# Altium schematic sheet CPU.SchDoc
size A3
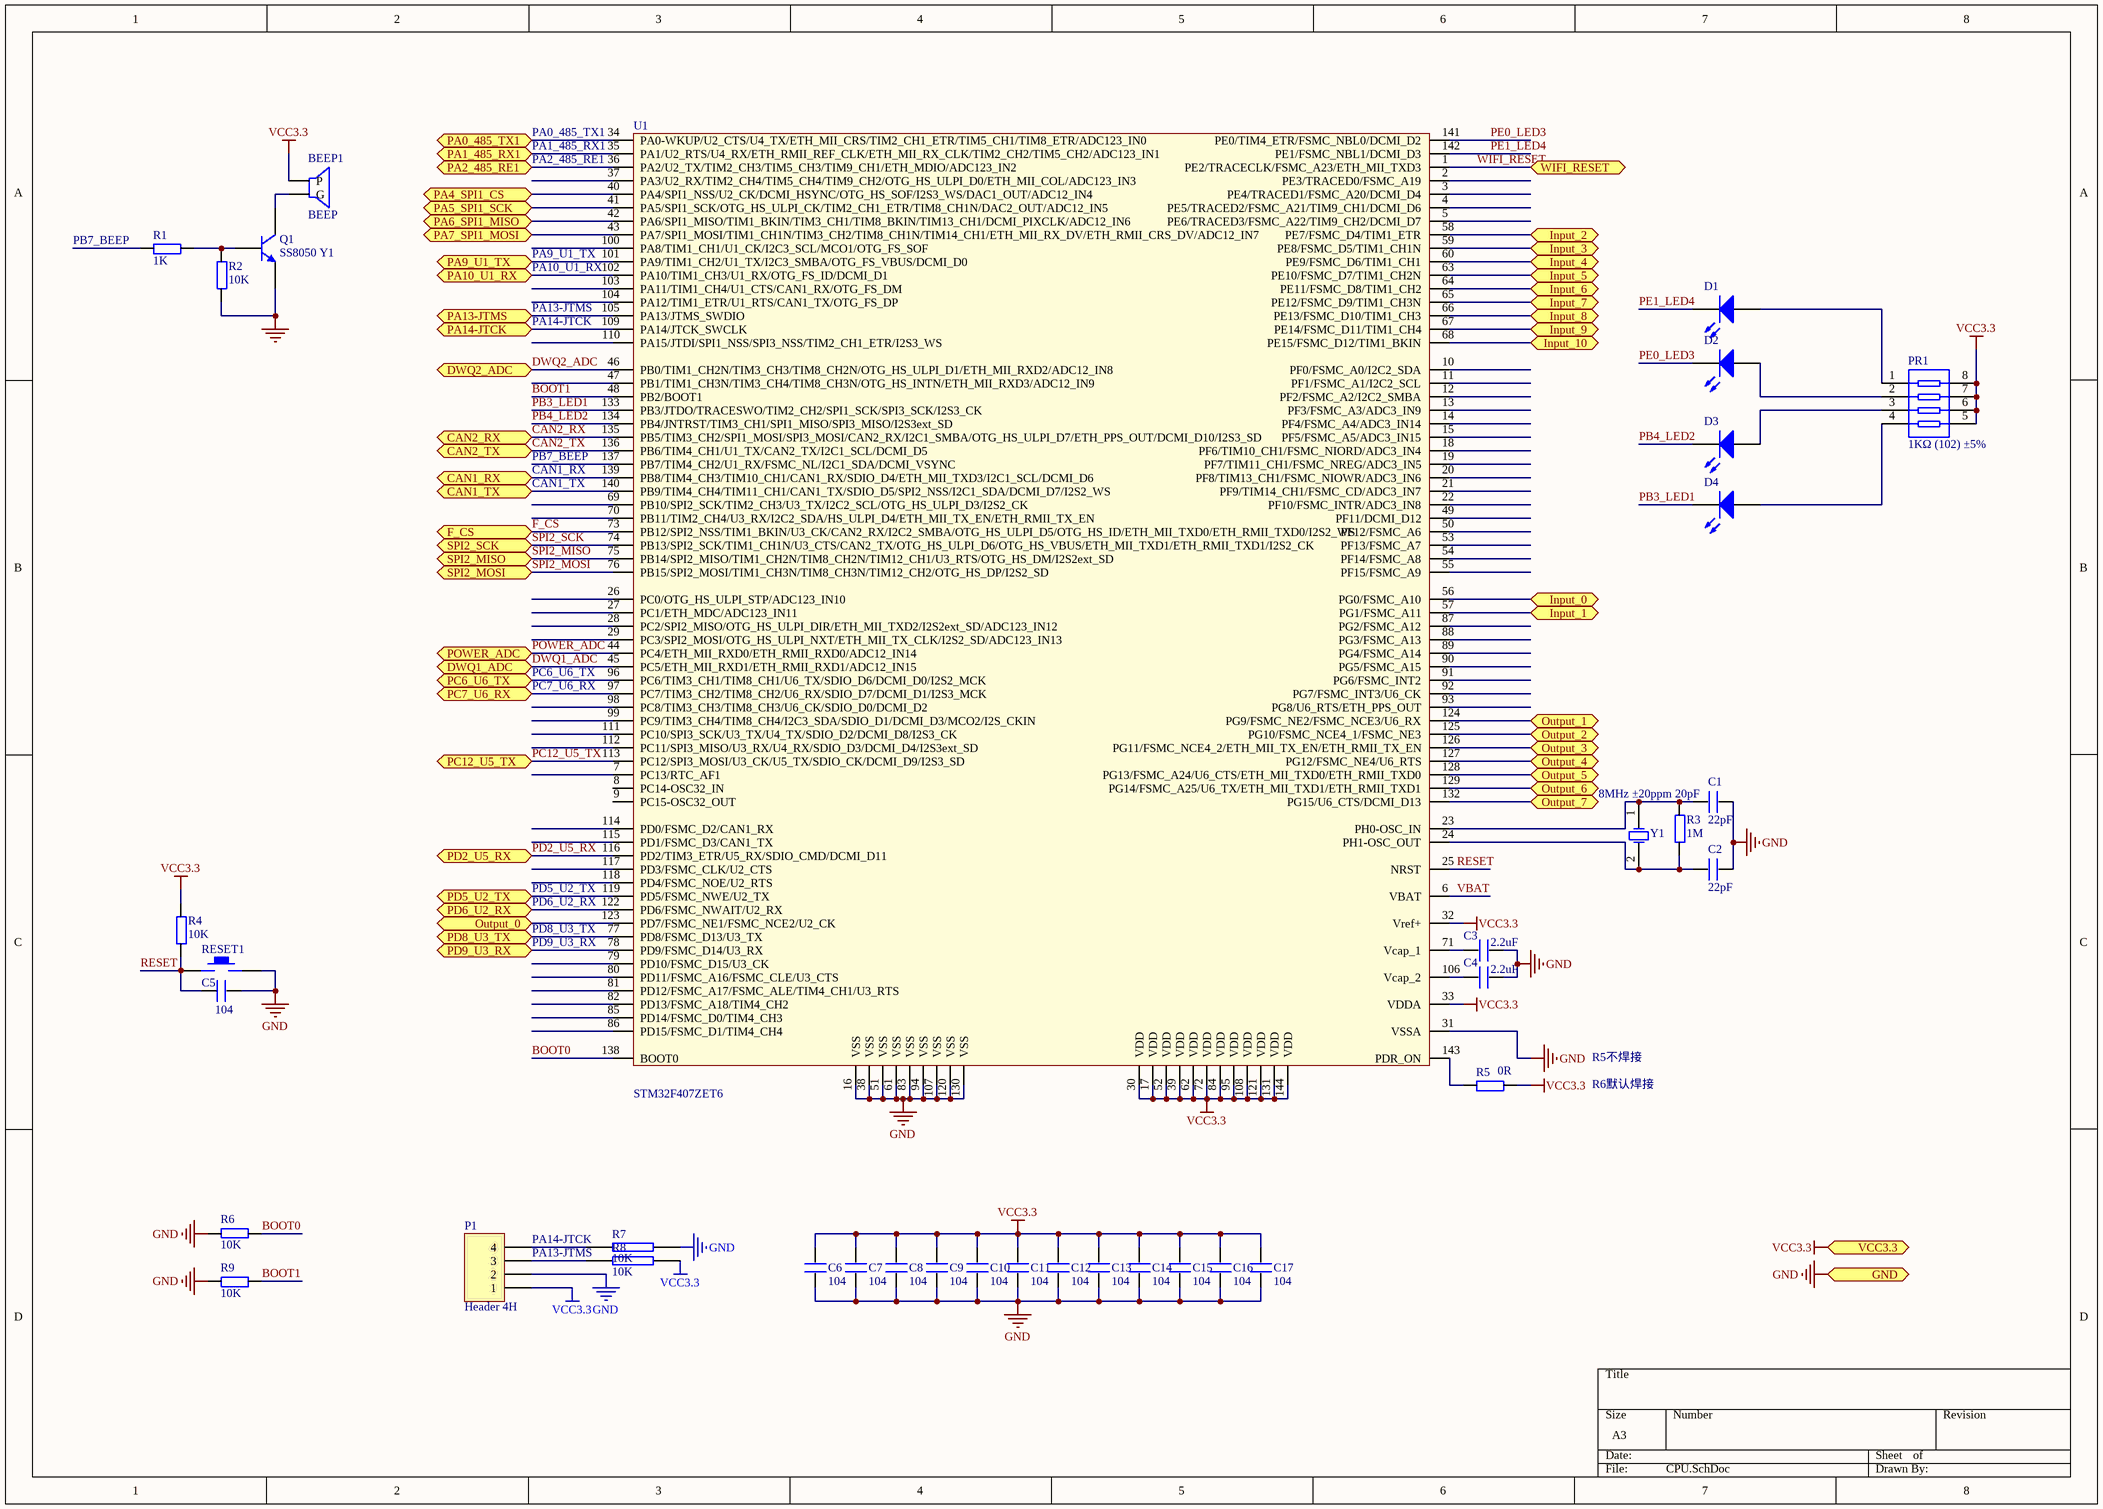
[diagram p0: CPU.SchDoc]

## Parts
BEEP1  BEEP  [BELL-5]
C1  22pF  [0603_C]
C2  22pF  [0603_C]
C3  2.2uF  [0603_C]
C4  2.2uF  [0603_C]
C5  104  [0603_C]
C6  104  [0603_C]
C7  104  [0603_C]
C8  104  [0603_C]
C9  104  [0603_C]
C10  104  [0603_C]
C11  104  [0603_C]
C12  104  [0603_C]
C13  104  [0603_C]
C14  104  [0603_C]
C15  104  [0603_C]
C16  104  [0603_C]
C17  104  [0603_C]
D1  红灯 0805  [LC-0805_LED_S1]  (value not drawn)
D2  红灯 0805  [LC-0805_LED_S1]  (value not drawn)
D3  红灯 0805  [LC-0805_LED_S1]  (value not drawn)
D4  红灯 0805  [LC-0805_LED_S1]  (value not drawn)
P1  Header 4H  [IDE4]
PR1  1KΩ (102) ±5%  [0603_Rx4]
Q1  SS8050 Y1  [SOT-23(SOT-23-3)]
R1  1K  [0603_R]
R2  10K  [0603_R]
R3  1M  [0603_R]
R4  10K  [0603_R]
R5  0R  [0603_R]
R6  10K  [0603_R]
R7  10K  [0603_R]
R8  10K  [0603_R]
R9  10K  [0603_R]
RESET1  KEY_M  [SW_PB2_A1]  (value not drawn)
U1  STM32F407ZET6  [LQFP-144_20x20x05P]
Y1  8MHz ±20ppm 20pF  [SMD-5032_2P]

## Ports
CAN1_RX, CAN1_TX, CAN2_RX, CAN2_TX, DWQ1_ADC, DWQ2_ADC, F_CS, GND, Input_0, Input_1, Input_2, Input_3, Input_4, Input_5, Input_6, Input_7, Input_8, Input_9, Input_10, Output_0, Output_1, Output_2, Output_3, Output_4, Output_5, Output_6, Output_7, PA0_485_TX1, PA1_485_RX1, PA2_485_RE1, PA4_SPI1_CS, PA5_SPI1_SCK, PA6_SPI1_MISO, PA7_SPI1_MOSI, PA9_U1_TX, PA10_U1_RX, PA13-JTMS, PA14-JTCK, PC6_U6_TX, PC7_U6_RX, PC12_U5_TX, PD2_U5_RX, PD5_U2_TX, PD6_U2_RX, PD8_U3_TX, PD9_U3_RX, POWER_ADC, SPI2_MISO, SPI2_MOSI, SPI2_SCK, VCC3.3, WIFI_RESET

## Nets
GND: C1.1 C2.1 C3.2 C4.2 C5.2 C6.1 C7.1 C8.1 C9.1 C10.1 C11.1 C12.1 C13.1 C14.1 C15.1 C16.1 C17.1 P1.2 Q1.2(E) R2.1 R6.2 R7.1 R9.1 RESET1.2 U1.16(VSS) U1.31(VSSA) U1.38(VSS) U1.51(VSS) U1.61(VSS) U1.83(VSS) U1.94(VSS) U1.107(VSS) U1.120(VSS) U1.130(VSS) ; port GND
VCC3.3: BEEP1.1(P) C6.2 C7.2 C8.2 C9.2 C10.2 C11.2 C12.2 C13.2 C14.2 C15.2 C16.2 C17.2 P1.1 PR1.5 PR1.6 PR1.7 PR1.8 R4.2 R5.2 R8.1 U1.17(VDD) U1.30(VDD) U1.32(Vref+) U1.33(VDDA) U1.39(VDD) U1.52(VDD) U1.62(VDD) U1.72(VDD) U1.84(VDD) U1.95(VDD) U1.108(VDD) U1.121(VDD) U1.131(VDD) U1.144(VDD) ; port VCC3.3
BOOT0: R6.1 U1.138(BOOT0)
BOOT1: R9.2 U1.48(PB2/BOOT1)
CAN1_RX: U1.139(PB8/TIM4_CH3/TIM10_CH1/CAN1_RX/SDIO_D4/ETH_MII_TXD3/I2C1_SCL/DCMI_D6) ; port CAN1_RX
CAN1_TX: U1.140(PB9/TIM4_CH4/TIM11_CH1/CAN1_TX/SDIO_D5/SPI2_NSS/I2C1_SDA/DCMI_D7/I2S2_WS) ; port CAN1_TX
CAN2_RX: U1.135(PB5/TIM3_CH2/SPI1_MOSI/SPI3_MOSI/CAN2_RX/I2C1_SMBA/OTG_HS_ULPI_D7/ETH_PPS_OUT/DCMI_D10/I2S3_SD) ; port CAN2_RX
CAN2_TX: U1.136(PB6/TIM4_CH1/U1_TX/CAN2_TX/I2C1_SCL/DCMI_D5) ; port CAN2_TX
DWQ1_ADC: U1.45(PC5/ETH_MII_RXD1/ETH_RMII_RXD1/ADC12_IN15) ; port DWQ1_ADC
DWQ2_ADC: U1.46(PB0/TIM1_CH2N/TIM3_CH3/TIM8_CH2N/OTG_HS_ULPI_D1/ETH_MII_RXD2/ADC12_IN8) ; port DWQ2_ADC
F_CS: U1.73(PB12/SPI2_NSS/TIM1_BKIN/U3_CK/CAN2_RX/I2C2_SMBA/OTG_HS_ULPI_D5/OTG_HS_ID/ETH_MII_TXD0/ETH_RMII_TXD0/I2S2_WS) ; port F_CS
Input_0: U1.56(PG0/FSMC_A10) ; port Input_0
Input_1: U1.57(PG1/FSMC_A11) ; port Input_1
Input_2: U1.58(PE7/FSMC_D4/TIM1_ETR) ; port Input_2
Input_3: U1.59(PE8/FSMC_D5/TIM1_CH1N) ; port Input_3
Input_4: U1.60(PE9/FSMC_D6/TIM1_CH1) ; port Input_4
Input_5: U1.63(PE10/FSMC_D7/TIM1_CH2N) ; port Input_5
Input_6: U1.64(PE11/FSMC_D8/TIM1_CH2) ; port Input_6
Input_7: U1.65(PE12/FSMC_D9/TIM1_CH3N) ; port Input_7
Input_8: U1.66(PE13/FSMC_D10/TIM1_CH3) ; port Input_8
Input_9: U1.67(PE14/FSMC_D11/TIM1_CH4) ; port Input_9
Input_10: U1.68(PE15/FSMC_D12/TIM1_BKIN) ; port Input_10
Output_0: U1.123(PD7/FSMC_NE1/FSMC_NCE2/U2_CK) ; port Output_0
Output_1: U1.124(PG9/FSMC_NE2/FSMC_NCE3/U6_RX) ; port Output_1
Output_2: U1.125(PG10/FSMC_NCE4_1/FSMC_NE3) ; port Output_2
Output_3: U1.126(PG11/FSMC_NCE4_2/ETH_MII_TX_EN/ETH_RMII_TX_EN) ; port Output_3
Output_4: U1.127(PG12/FSMC_NE4/U6_RTS) ; port Output_4
Output_5: U1.128(PG13/FSMC_A24/U6_CTS/ETH_MII_TXD0/ETH_RMII_TXD0) ; port Output_5
Output_6: U1.129(PG14/FSMC_A25/U6_TX/ETH_MII_TXD1/ETH_RMII_TXD1) ; port Output_6
Output_7: U1.132(PG15/U6_CTS/DCMI_D13) ; port Output_7
PA0_485_TX1: U1.34(PA0-WKUP/U2_CTS/U4_TX/ETH_MII_CRS/TIM2_CH1_ETR/TIM5_CH1/TIM8_ETR/ADC123_IN0) ; port PA0_485_TX1
PA1_485_RX1: U1.35(PA1/U2_RTS/U4_RX/ETH_RMII_REF_CLK/ETH_MII_RX_CLK/TIM2_CH2/TIM5_CH2/ADC123_IN1) ; port PA1_485_RX1
PA2_485_RE1: U1.36(PA2/U2_TX/TIM2_CH3/TIM5_CH3/TIM9_CH1/ETH_MDIO/ADC123_IN2) ; port PA2_485_RE1
PA4_SPI1_CS: U1.40(PA4/SPI1_NSS/U2_CK/DCMI_HSYNC/OTG_HS_SOF/I2S3_WS/DAC1_OUT/ADC12_IN4) ; port PA4_SPI1_CS
PA5_SPI1_SCK: U1.41(PA5/SPI1_SCK/OTG_HS_ULPI_CK/TIM2_CH1_ETR/TIM8_CH1N/DAC2_OUT/ADC12_IN5) ; port PA5_SPI1_SCK
PA6_SPI1_MISO: U1.42(PA6/SPI1_MISO/TIM1_BKIN/TIM3_CH1/TIM8_BKIN/TIM13_CH1/DCMI_PIXCLK/ADC12_IN6) ; port PA6_SPI1_MISO
PA7_SPI1_MOSI: U1.43(PA7/SPI1_MOSI/TIM1_CH1N/TIM3_CH2/TIM8_CH1N/TIM14_CH1/ETH_MII_RX_DV/ETH_RMII_CRS_DV/ADC12_IN7) ; port PA7_SPI1_MOSI
PA9_U1_TX: U1.101(PA9/TIM1_CH2/U1_TX/I2C3_SMBA/OTG_FS_VBUS/DCMI_D0) ; port PA9_U1_TX
PA10_U1_RX: U1.102(PA10/TIM1_CH3/U1_RX/OTG_FS_ID/DCMI_D1) ; port PA10_U1_RX
PA13-JTMS: P1.3 R8.2 U1.105(PA13/JTMS_SWDIO) ; port PA13-JTMS
PA14-JTCK: P1.4 R7.2 U1.109(PA14/JTCK_SWCLK) ; port PA14-JTCK
PB3_LED1: D4.K U1.133(PB3/JTDO/TRACESWO/TIM2_CH2/SPI1_SCK/SPI3_SCK/I2S3_CK)
PB4_LED2: D3.K U1.134(PB4/JNTRST/TIM3_CH1/SPI1_MISO/SPI3_MISO/I2S3ext_SD)
PB7_BEEP: R1.1 U1.137(PB7/TIM4_CH2/U1_RX/FSMC_NL/I2C1_SDA/DCMI_VSYNC)
PC6_U6_TX: U1.96(PC6/TIM3_CH1/TIM8_CH1/U6_TX/SDIO_D6/DCMI_D0/I2S2_MCK) ; port PC6_U6_TX
PC7_U6_RX: U1.97(PC7/TIM3_CH2/TIM8_CH2/U6_RX/SDIO_D7/DCMI_D1/I2S3_MCK) ; port PC7_U6_RX
PC12_U5_TX: U1.113(PC12/SPI3_MOSI/U3_CK/U5_TX/SDIO_CK/DCMI_D9/I2S3_SD) ; port PC12_U5_TX
PD2_U5_RX: U1.116(PD2/TIM3_ETR/U5_RX/SDIO_CMD/DCMI_D11) ; port PD2_U5_RX
PD5_U2_TX: U1.119(PD5/FSMC_NWE/U2_TX) ; port PD5_U2_TX
PD6_U2_RX: U1.122(PD6/FSMC_NWAIT/U2_RX) ; port PD6_U2_RX
PD8_U3_TX: U1.77(PD8/FSMC_D13/U3_TX) ; port PD8_U3_TX
PD9_U3_RX: U1.78(PD9/FSMC_D14/U3_RX) ; port PD9_U3_RX
PE0_LED3: D2.K U1.141(PE0/TIM4_ETR/FSMC_NBL0/DCMI_D2)
PE1_LED4: D1.K U1.142(PE1/FSMC_NBL1/DCMI_D3)
POWER_ADC: U1.44(PC4/ETH_MII_RXD0/ETH_RMII_RXD0/ADC12_IN14) ; port POWER_ADC
RESET: C5.1 R4.1 RESET1.1 U1.25(NRST)
SPI2_MISO: U1.75(PB14/SPI2_MISO/TIM1_CH2N/TIM8_CH2N/TIM12_CH1/U3_RTS/OTG_HS_DM/I2S2ext_SD) ; port SPI2_MISO
SPI2_MOSI: U1.76(PB15/SPI2_MOSI/TIM1_CH3N/TIM8_CH3N/TIM12_CH2/OTG_HS_DP/I2S2_SD) ; port SPI2_MOSI
SPI2_SCK: U1.74(PB13/SPI2_SCK/TIM1_CH1N/U3_CTS/CAN2_TX/OTG_HS_ULPI_D6/OTG_HS_VBUS/ETH_MII_TXD1/ETH_RMII_TXD1/I2S2_CK) ; port SPI2_SCK
VBAT: U1.6(VBAT)
WIFI_RESET: U1.1(PE2/TRACECLK/FSMC_A23/ETH_MII_TXD3) ; port WIFI_RESET
NetBEEP1_2: BEEP1.2(G) Q1.3(C)
NetC1_2: C1.2 R3.2 U1.23(PH0-OSC_IN) Y1.1(OSC1)
NetC2_2: C2.2 R3.1 U1.24(PH1-OSC_OUT) Y1.2(OSC2)
NetC3_1: C3.1 U1.71(Vcap_1)
NetC4_1: C4.1 U1.106(Vcap_2)
NetD1_A: D1.A PR1.1
NetD2_A: D2.A PR1.2
NetD3_A: D3.A PR1.3
NetD4_A: D4.A PR1.4
NetQ1_1: Q1.1(B) R1.2 R2.2
NetR5_1: R5.1 U1.143(PDR_ON)

Not connected (* = marked no-connect by the designer): U1 2(PE3/TRACED0/FSMC_A19) 3(PE4/TRACED1/FSMC_A20/DCMI_D4) 4(PE5/TRACED2/FSMC_A21/TIM9_CH1/DCMI_D6) 5(PE6/TRACED3/FSMC_A22/TIM9_CH2/DCMI_D7) 7(PC13/RTC_AF1) 8(PC14-OSC32_IN) 9(PC15-OSC32_OUT) 10(PF0/FSMC_A0/I2C2_SDA) 11(PF1/FSMC_A1/I2C2_SCL) 12(PF2/FSMC_A2/I2C2_SMBA) 13(PF3/FSMC_A3/ADC3_IN9) 14(PF4/FSMC_A4/ADC3_IN14) 15(PF5/FSMC_A5/ADC3_IN15) 18(PF6/TIM10_CH1/FSMC_NIORD/ADC3_IN4) 19(PF7/TIM11_CH1/FSMC_NREG/ADC3_IN5) 20(PF8/TIM13_CH1/FSMC_NIOWR/ADC3_IN6) 21(PF9/TIM14_CH1/FSMC_CD/ADC3_IN7) 22(PF10/FSMC_INTR/ADC3_IN8) 26(PC0/OTG_HS_ULPI_STP/ADC123_IN10) 27(PC1/ETH_MDC/ADC123_IN11) 28(PC2/SPI2_MISO/OTG_HS_ULPI_DIR/ETH_MII_TXD2/I2S2ext_SD/ADC123_IN12) 29(PC3/SPI2_MOSI/OTG_HS_ULPI_NXT/ETH_MII_TX_CLK/I2S2_SD/ADC123_IN13) 37(PA3/U2_RX/TIM2_CH4/TIM5_CH4/TIM9_CH2/OTG_HS_ULPI_D0/ETH_MII_COL/ADC123_IN3) 47(PB1/TIM1_CH3N/TIM3_CH4/TIM8_CH3N/OTG_HS_INTN/ETH_MII_RXD3/ADC12_IN9) 49(PF11/DCMI_D12) 50(PF12/FSMC_A6) 53(PF13/FSMC_A7) 54(PF14/FSMC_A8) 55(PF15/FSMC_A9) 69(PB10/SPI2_SCK/TIM2_CH3/U3_TX/I2C2_SCL/OTG_HS_ULPI_D3/I2S2_CK) 70(PB11/TIM2_CH4/U3_RX/I2C2_SDA/HS_ULPI_D4/ETH_MII_TX_EN/ETH_RMII_TX_EN) 79(PD10/FSMC_D15/U3_CK) 80(PD11/FSMC_A16/FSMC_CLE/U3_CTS) 81(PD12/FSMC_A17/FSMC_ALE/TIM4_CH1/U3_RTS) 82(PD13/FSMC_A18/TIM4_CH2) 85(PD14/FSMC_D0/TIM4_CH3) 86(PD15/FSMC_D1/TIM4_CH4) 87(PG2/FSMC_A12) 88(PG3/FSMC_A13) 89(PG4/FSMC_A14) 90(PG5/FSMC_A15) 91(PG6/FSMC_INT2) 92(PG7/FSMC_INT3/U6_CK) 93(PG8/U6_RTS/ETH_PPS_OUT) 98(PC8/TIM3_CH3/TIM8_CH3/U6_CK/SDIO_D0/DCMI_D2) 99(PC9/TIM3_CH4/TIM8_CH4/I2C3_SDA/SDIO_D1/DCMI_D3/MCO2/I2S_CKIN) 100(PA8/TIM1_CH1/U1_CK/I2C3_SCL/MCO1/OTG_FS_SOF) 103(PA11/TIM1_CH4/U1_CTS/CAN1_RX/OTG_FS_DM) 104(PA12/TIM1_ETR/U1_RTS/CAN1_TX/OTG_FS_DP) 110(PA15/JTDI/SPI1_NSS/SPI3_NSS/TIM2_CH1_ETR/I2S3_WS) 111(PC10/SPI3_SCK/U3_TX/U4_TX/SDIO_D2/DCMI_D8/I2S3_CK) 112(PC11/SPI3_MISO/U3_RX/U4_RX/SDIO_D3/DCMI_D4/I2S3ext_SD) 114(PD0/FSMC_D2/CAN1_RX) 115(PD1/FSMC_D3/CAN1_TX) 117(PD3/FSMC_CLK/U2_CTS) 118(PD4/FSMC_NOE/U2_RTS)

## Notes on the sheet
- R5不焊接
- R6默认焊接

## Library data of the parts
C1 C2 = C_3
C3-C17 = C
D1-D4 = LED0: Typical INFRARED GaAs LED; Published: 8-Jun-2000; LatestRevisionDate: 08-Jul-2005; LatestRevisionNote: Mech Layer 1 removed.; PackageReference: LED-0; Publisher: Altium Limited; PackageDescription: LED; 2 Leads
P1 = Header 4H: Header, 4-Pin, Right Angle; LatestRevisionDate: 17-Jul-2002; LatestRevisionNote: Re-released for DXP Platform.; Publisher: Altium Limited
PR1 = 0603*4  1KΩ (102) 5%: 贴片排阻; ComponentLink1Description: 供应商链接; ComponentLink1URL: http://www.szlcsc.com/product/details_20907.html; Package: 0603*4; Supplier: LC; SuppliersPartNumber: C20197
Q1 = SOT-23 SS8050 Y1: 三极管; ComponentLink1Description: 供应商链接; ComponentLink1URL: http://www.szlcsc.com/product/details_2507.html; Package: SOT-23; Supplier: LC; SuppliersPartNumber: C2150
R1-R3 = R
R4 R5 = R_2
R6 R9 = R_1
R7 R8 = RES2
Y1 = SMD-5032_2P 8MHz 20ppm 20pF: 贴片晶振; ComponentLink1Description: 供应商链接; ComponentLink1URL: http://www.szlcsc.com/product/details_117214.html; Package: SMD-5032_2P; Supplier: LC; SuppliersPartNumber: C115962